# EAGLE schematic mega-halfshield-MOB (EAGLE 8.3.2)
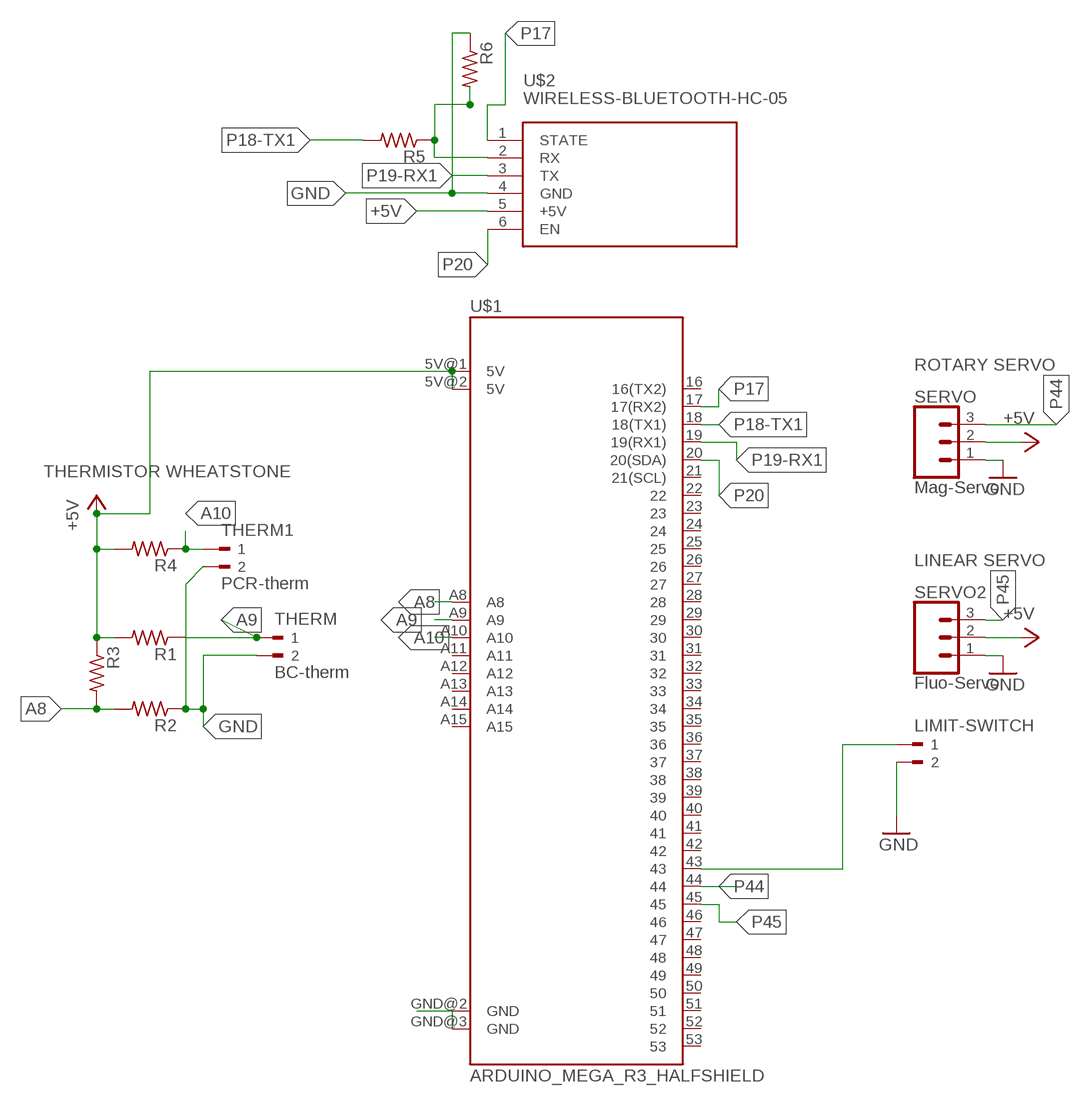
[diagram p0: schematic, sheet 1]

## Parts
LIMIT-SWITCH  90-2  [90-2]
R1  R-US_0309/10  [0309/10]
R2  R-US_0309/10  [0309/10]
R3  R-US_0309/10  [0309/10]
R4  R-US_0309/10  [0309/10]
R5  R-US_0309/10  [0309/10]
R6  R-US_0309/10  [0309/10]
SERVO  Mag-Servo  CONN_03  [1X03]
SERVO2  Fluo-Servo  CONN_03  [1X03]
THERM  BC-therm  90-2  [90-2]
THERM1  PCR-therm  90-2  [90-2]
U$1  ARDUINO_MEGA_R3_HALFSHIELD  [ARDUINO_MEGA_HALFSHIELD]
U$2  WIRELESS-BLUETOOTH-HC-05  [WIRELESS-BLUETOOTH-HC-05]

## Nets
+5V [high current]: R1.2 R3.1 R4.2 SERVO2.2 SERVO.2 U$1.5V@1(5V) U$1.5V@2(5V) U$2.5(+5V)
A8: R2.2 R3.2 U$1.A8
A9: R1.1 THERM.1 U$1.A9
A10: R4.1 THERM1.1 U$1.A10
GND [high current]: LIMIT-SWITCH.2 R2.1 R6.1 SERVO2.1 SERVO.1 THERM1.2 THERM.2 U$1.GND@2(GND) U$1.GND@3(GND) U$2.4(GND)
N$1: LIMIT-SWITCH.1 U$1.43
N$2: R5.1 R6.2 U$2.2(RX)
P17: U$1.17(17(RX2)) U$2.1(STATE)
P18-TX1: R5.2 U$1.18(18(TX1))
P19-RX1: U$1.19(19(RX1)) U$2.3(TX)
P20: U$1.20(20(SDA)) U$2.6(EN)
P44: SERVO.3 U$1.44
P45: SERVO2.3 U$1.45
Unconnected: U$1.16(16(TX2)) U$1.21(21(SCL)) U$1.22 U$1.23 U$1.24 U$1.25 U$1.26 U$1.27 U$1.28 U$1.29 U$1.30 U$1.31 U$1.32 U$1.33 U$1.34 U$1.35 U$1.36 U$1.37 U$1.38 U$1.39 U$1.40 U$1.41 U$1.42 U$1.46 U$1.47 U$1.48 U$1.49 U$1.50 U$1.51 U$1.52 U$1.53 U$1.A11 U$1.A12 U$1.A13 U$1.A14 U$1.A15

## Notes on the sheet
- ROTARY SERVO
- THERMISTOR WHEATSTONE
- LINEAR SERVO

## Library data of the parts
LIMIT-SWITCH THERM THERM1 = con-weidmueller-sl35:90-2: WEIDMUELLER CLAMP CONNECTOR; OC_FARNELL: unknown; OC_NEWARK: unknown
R1-R6 = rcl:R-US_: RESISTOR, American symbol
SERVO SERVO2 = SparkFun-Connectors:CONN_03: Multi connection point. Often used as Generic Header-pin footprint for 0.1 inch spaced/style header connections On any of the 0.1 inch spaced packages, you can populate with these: Break Away Headers - Straight <https://www.sparkfun.com/products/116> (PRT-00116) Break Away Male Headers - Right Angle <https://www.sparkfun.com/products/553> (PRT-00553) Female Headers <https://www.sparkfun.com/products/115> (PRT-00115) Break Away Headers - Machine Pin <https://www.sparkfun.com/products/117> (PRT-00117) Break Away Female Headers - Swiss Machine Pin <https://www.sparkfun.com/products/743> (PRT-00743) Stackable Header - 3 Pin (Female, 0.1") <https://www.sparkfun.com/products/13875> (PRT-13875) For SCREWTERMINALS and SPRING TERMINALS visit here: Screw Terimnals on SparkFun.com <https://www.sparkfun.com/search/results?term=Screw+Terminals> (5mm/3.5mm/2.54mm spacing) This device is also useful as a general connection point to wire up your design to another part of your project. Our various solder wires solder well into these plated through hole pads. Hook-Up Wire - Assortment (Stranded, 22 AWG) <https://www.sparkfun.com/products/11375> (PRT-11375) Hook-Up Wire - Assortment (Solid Core, 22 AWG) <https://www.sparkfun.com/products/11367> (PRT-11367) View the entire wire category on our website here <https://www.sparkfun.com/categories/141> Special notes: Molex polarized connector foot print use with SKU : PRT-08232 with associated crimp pins and housings.
U$1 = alex.trick:ARDUINO_MEGA_R3_HALFSHIELD
U$2 = diy-modules:WIRELESS-BLUETOOTH-HC-05: Bluetooth Transceiver Module based on HC-05 board Tutorial is available here: https://arduino-info.wikispaces.com/BlueTooth-HC05-HC06-Modules-How-To Click here to find device on ebay.com <http://www.ebay.com/sch/hc-05+module+rs232>

## Net classes
0 default: width 0.15 mm, drill 0.3 mm, clearance 0.15 mm
1 high current: width 1.27 mm, drill 0.3 mm, clearance 0.15 mm